# Altium schematic sheet EPS_Distribution_LCL-TK.SchDoc: Distribution / LCL-TK
size A3; SheetNumber: 50; SheetTotal: 51
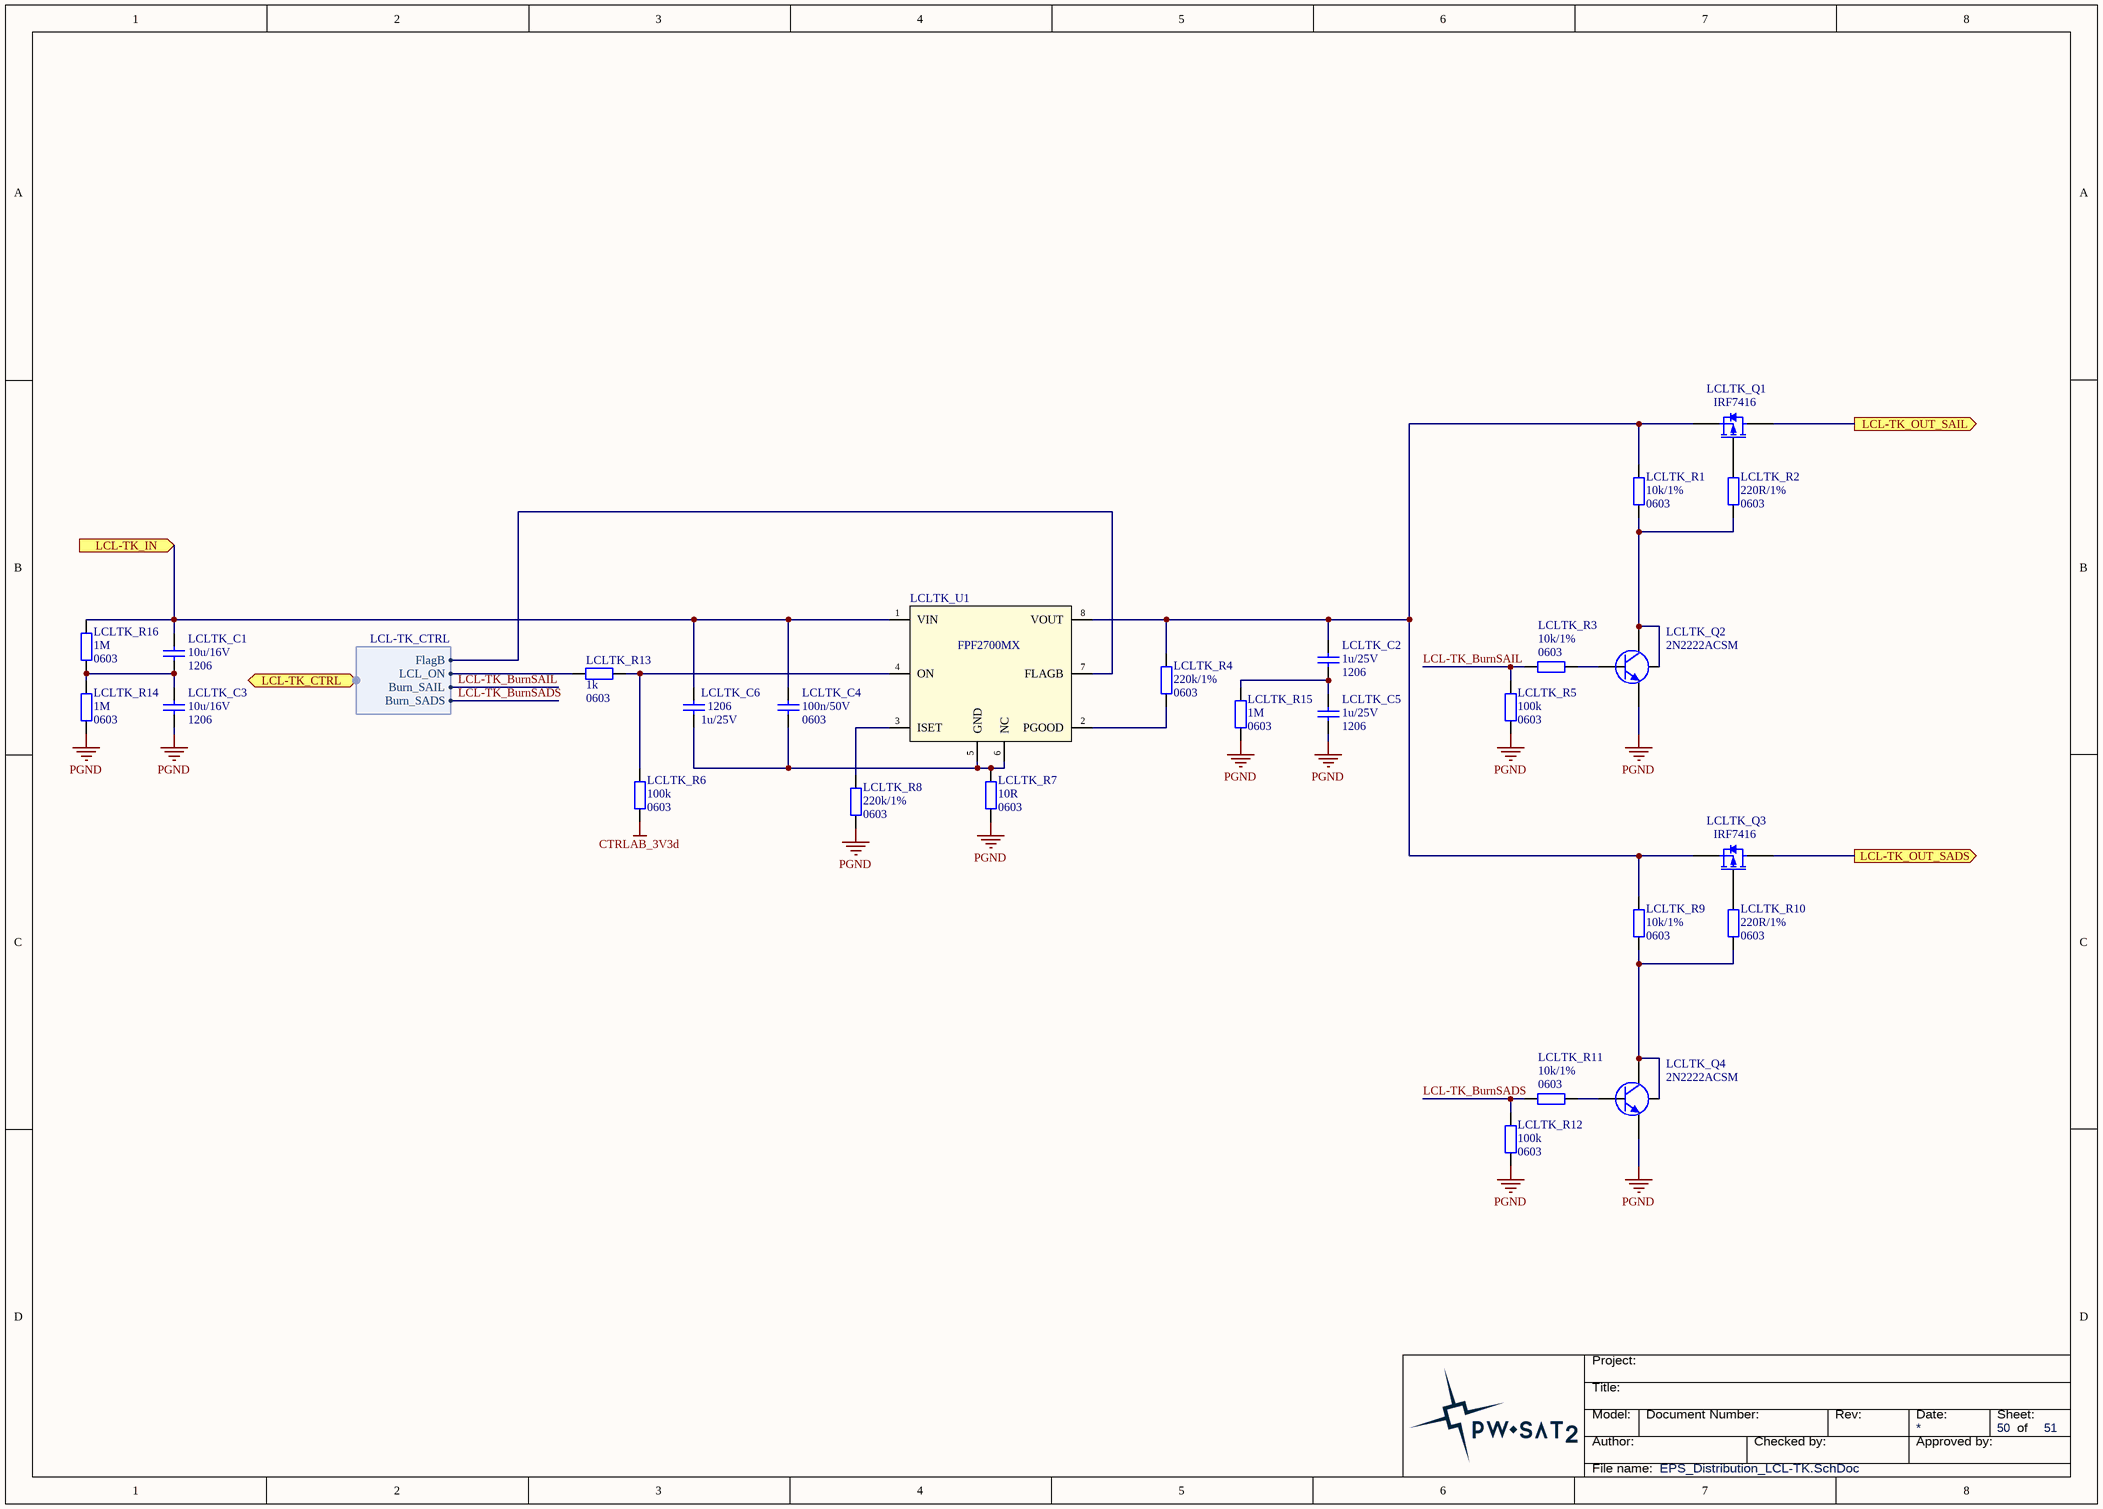
[diagram p0: EPS_Distribution_LCL-TK.SchDoc]

## Parts
LCLTK_C1  Packge: 1206  [SMD_Capacitor_1206]  (hidden comment: 10u/16V)
LCLTK_C2  Package: 1206  [SMD_Capacitor_1206]  (hidden comment: 1u/25V)
LCLTK_C3  Packge: 1206  [SMD_Capacitor_1206]  (hidden comment: 10u/16V)
LCLTK_C4  Package: 0603  [SMD_Capacitor_0603]  (hidden comment: 100n/50V)
LCLTK_C5  Package: 1206  [SMD_Capacitor_1206]  (hidden comment: 1u/25V)
LCLTK_C6  Package: 1206  [SMD_Capacitor_1206]  (hidden comment: 1u/25V)
LCLTK_Q1  IRF7416  [SOIC-8-N_SSSGDDDD]
LCLTK_Q2  2N2222ACSM  [LCC1-4_BEC]
LCLTK_Q3  IRF7416  [SOIC-8-N_SSSGDDDD]
LCLTK_Q4  2N2222ACSM  [LCC1-4_BEC]
LCLTK_R1  Package: 0603  [SMD_Resistor_0603]  (hidden comment: 10k/1%)
LCLTK_R2  Package: 0603  [SMD_Resistor_0603]  (hidden comment: 220R/1%)
LCLTK_R3  Package: 0603  [SMD_Resistor_0603]  (hidden comment: 10k/1%)
LCLTK_R4  Package: 0603  [SMD_Resistor_0603]  (hidden comment: 220k/1%)
LCLTK_R5  Package: 0603  [SMD_Resistor_0603]  (hidden comment: 100k)
LCLTK_R6  Package: 0603  [SMD_Resistor_0603]  (hidden comment: 100k)
LCLTK_R7  Package: 0603  [SMD_Resistor_0603]  (hidden comment: 10R)
LCLTK_R8  Package: 0603  [SMD_Resistor_0603]  (hidden comment: 220k/1%)
LCLTK_R9  Package: 0603  [SMD_Resistor_0603]  (hidden comment: 10k/1%)
LCLTK_R10  Package: 0603  [SMD_Resistor_0603]  (hidden comment: 220R/1%)
LCLTK_R11  Package: 0603  [SMD_Resistor_0603]  (hidden comment: 10k/1%)
LCLTK_R12  Package: 0603  [SMD_Resistor_0603]  (hidden comment: 100k)
LCLTK_R13  Package: 0603  [SMD_Resistor_0603]  (hidden comment: 1k)
LCLTK_R14  Package: 0603  [SMD_Resistor_0603]  (hidden comment: 1M)
LCLTK_R15  Package: 0603  [SMD_Resistor_0603]  (hidden comment: 1M)
LCLTK_R16  Package: 0603  [SMD_Resistor_0603]  (hidden comment: 1M)
LCLTK_U1  FPF2700MX  [SOIC-8-N]

## Ports
LCL-TK_CTRL (harness LCL-TK_CTRL), LCL-TK_IN (in), LCL-TK_OUT_SADS (out), LCL-TK_OUT_SAIL (out)

## Harnesses
LCL-TK_CTRL: FlagB, LCL_ON, Burn_SAIL, Burn_SADS

## Nets
CTRLAB_3V3d: LCLTK_R6.1
PGND: LCLTK_C3.2 LCLTK_C5.2 LCLTK_Q2.E LCLTK_Q4.E LCLTK_R5.1 LCLTK_R7.1 LCLTK_R8.1 LCLTK_R12.1 LCLTK_R14.1 LCLTK_R15.1
LCL-TK_BurnSADS: LCLTK_R11.2 LCLTK_R12.2 ; port LCL-TK_CTRL.Burn_SADS
LCL-TK_BurnSAIL: LCLTK_R3.2 LCLTK_R5.2 ; port LCL-TK_CTRL.Burn_SAIL
LCL-TK_IN: LCLTK_C1.1 LCLTK_C4.1 LCLTK_C6.1 LCLTK_R16.2 LCLTK_U1.1(VIN) ; port LCL-TK_IN
LCL-TK_OUT_SADS: LCLTK_Q3.D ; port LCL-TK_OUT_SADS
LCL-TK_OUT_SAIL: LCLTK_Q1.D ; port LCL-TK_OUT_SAIL
NetLCLTK_C1_2: LCLTK_C1.2 LCLTK_C3.1 LCLTK_R14.2 LCLTK_R16.1
NetLCLTK_C2_1: LCLTK_C2.1 LCLTK_Q1.S LCLTK_Q3.S LCLTK_R1.2 LCLTK_R4.2 LCLTK_R9.2 LCLTK_U1.8(VOUT)
NetLCLTK_C2_2: LCLTK_C2.2 LCLTK_C5.1 LCLTK_R15.2
NetLCLTK_C4_2: LCLTK_C4.2 LCLTK_C6.2 LCLTK_R7.2 LCLTK_U1.5(GND) LCLTK_U1.6(NC)
NetLCLTK_Q1_G: LCLTK_Q1.G LCLTK_R2.2
NetLCLTK_Q2_B: LCLTK_Q2.B LCLTK_R3.1
NetLCLTK_Q2_C: LCLTK_Q2.C LCLTK_Q2.Shield LCLTK_R1.1 LCLTK_R2.1
NetLCLTK_Q3_G: LCLTK_Q3.G LCLTK_R10.2
NetLCLTK_Q4_B: LCLTK_Q4.B LCLTK_R11.1
NetLCLTK_Q4_C: LCLTK_Q4.C LCLTK_Q4.Shield LCLTK_R9.1 LCLTK_R10.1
NetLCLTK_R4_1: LCLTK_R4.1 LCLTK_U1.2(PGOOD)
NetLCLTK_R6_2: LCLTK_R6.2 LCLTK_R13.1 LCLTK_U1.4(ON)
NetLCLTK_R8_2: LCLTK_R8.2 LCLTK_U1.3(ISET)
NetLCLTK_R13_2: LCLTK_R13.2 ; port LCL-TK_CTRL.LCL_ON
NetLCLTK_U1_7: LCLTK_U1.7(FLAGB) ; port LCL-TK_CTRL.FlagB

## Notes on the sheet
- Title:
- Project:
- Author:
- Model:
- Document Number:
- Checked by:
- Rev:
- Date:
- Approved by:
- Sheet:
- of
- File name:

## Library data of the parts
LCLTK_C1 LCLTK_C3 = Cer_C1206T106K4RACTU: Ceramic Cap Kemet COTS 10u/16V X7R 1206; ManufacturerPartNumber: C1206T106K4RACTU; Manufacturer: Kemet; Value: 10u/16V
LCLTK_C2 LCLTK_C5 LCLTK_C6 = Cer_C1206T105K3RALTU: Ceramic Cap Kemet COTS 1u/25V X7R 1206; ManufacturerPartNumber: C1206T105K3RALTU; Manufacturer: Kemet; Value: 1u/25V
LCLTK_C4 = Cer_C0603T104K5RALTU: Ceramic Cap Kemet COTS 100n/50V X7R 0603; Manufacturer: Kemet; ManufacturerPartNumber: C0603T104K5RALTU; Value: 100n/50V
LCLTK_Q1 LCLTK_Q3 = IRF7416: 10A/30V HEXFET Power P-MOSFET.; Manufacturer: International Rectifier; Value: IRF7416
LCLTK_Q2 LCLTK_Q4 = 2N2222ACSM: Silicon Planar Epitaxial NPN Transistor.; Manufacturer: Semelab-TT; Value: 2N2222ACSM
LCLTK_R1-LCLTK_R16 = Res
  LCLTK_R1 LCLTK_R3 LCLTK_R9 LCLTK_R11: Value: 10k/1%
  LCLTK_R2 LCLTK_R10: Value: 220R/1%
  LCLTK_R4 LCLTK_R8: Value: 220k/1%
  LCLTK_R5 LCLTK_R6 LCLTK_R12: Value: 100k
  LCLTK_R7: Value: 10R
  LCLTK_R13: Value: 1k
  LCLTK_R14-LCLTK_R16: Value: 1M
LCLTK_U1 = FPF2700MX: Adj over-current protection 0.4-2A, Load Switch; Manufacturer: Fairchild Semiconductor; Value: FPF2700MX